# EAGLE design LoRa_Node_Schematic (EAGLE 9.6.2)

## Sheet 1 of 2
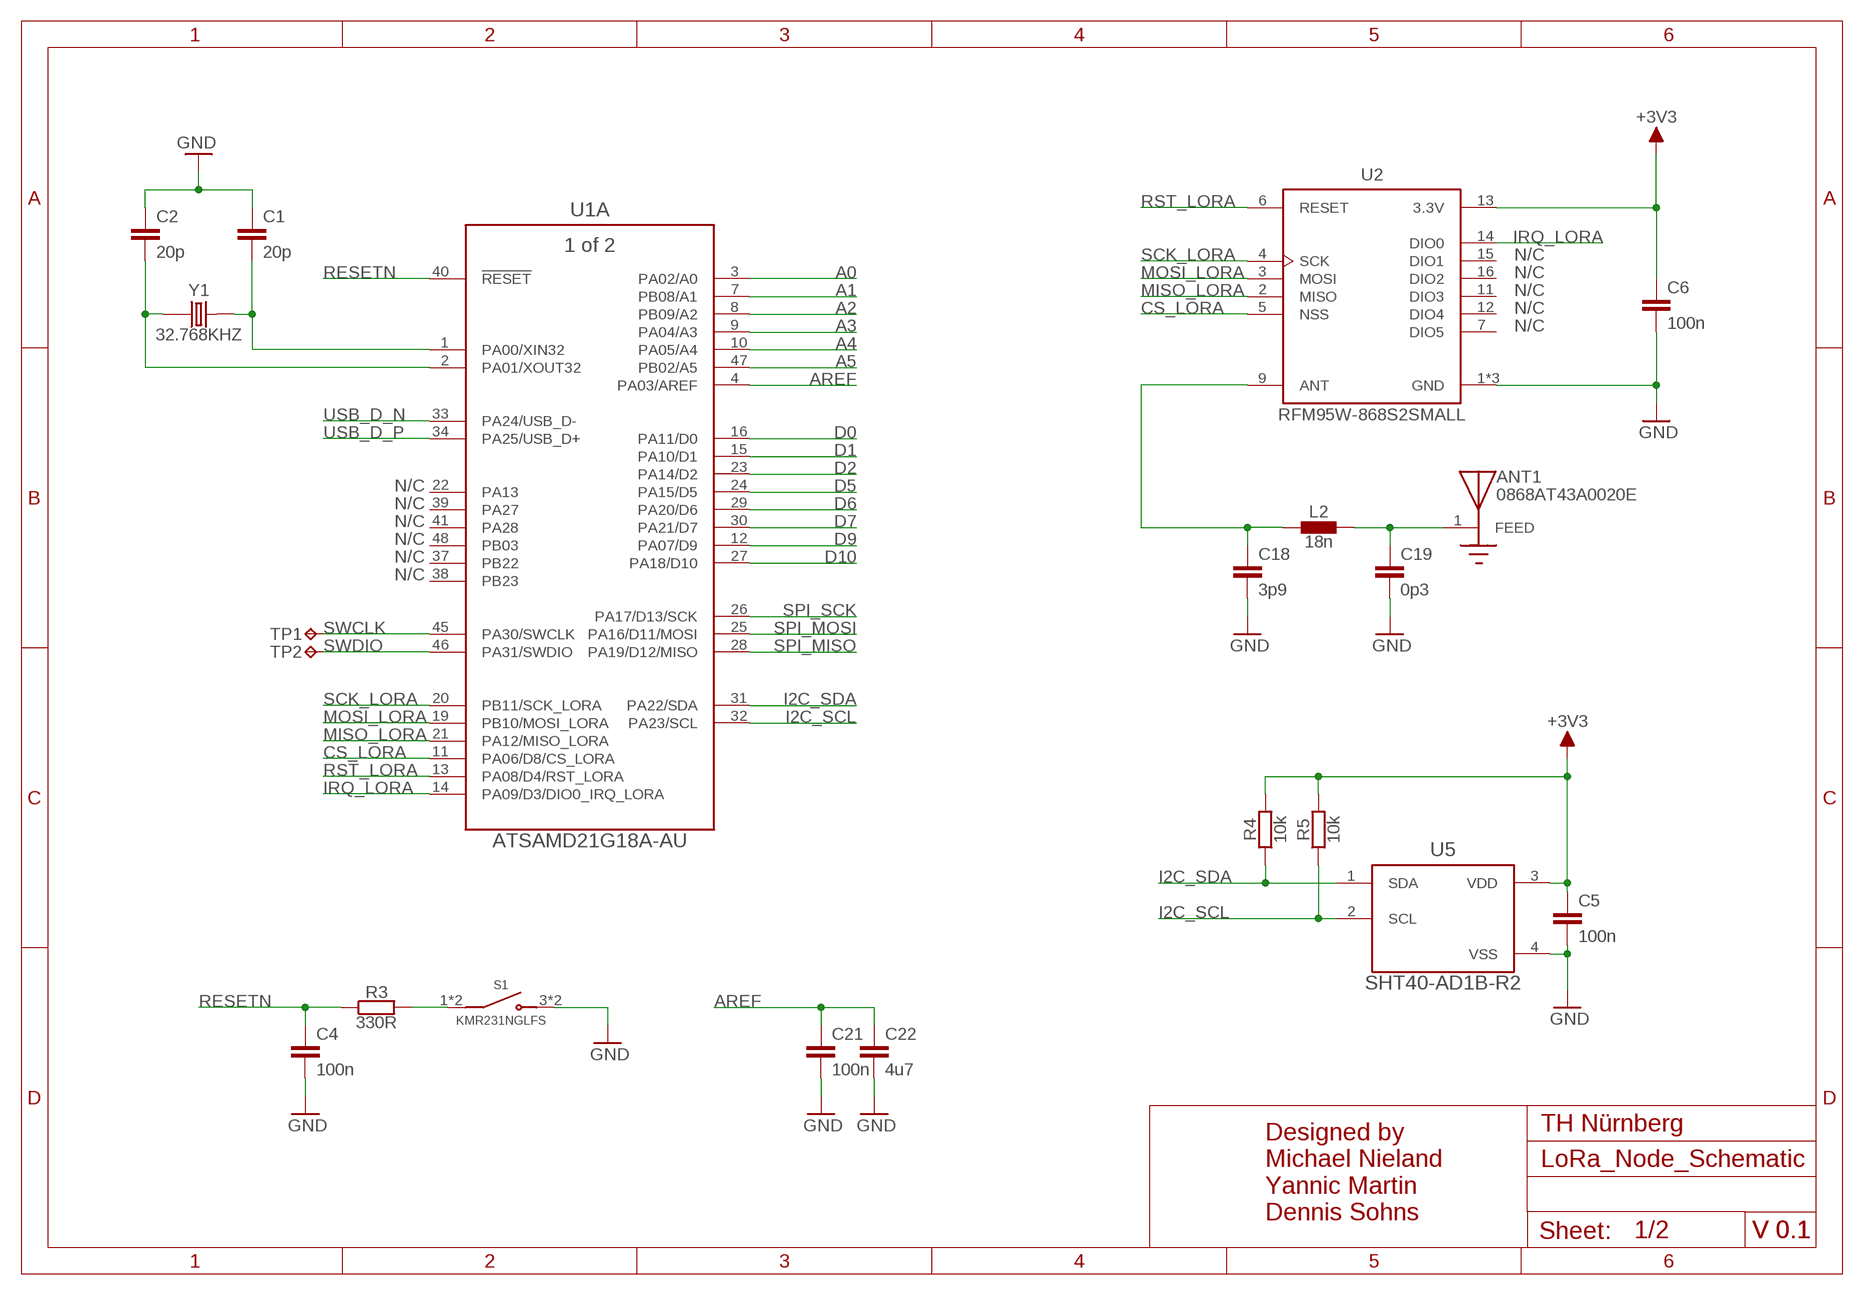
[diagram p0: schematic, sheet 1]

### Parts
ANT1  0868AT43A0020E  [XCVR_0868AT43A0020E]
C1  20p  C-EUC0402  [C0402]
C2  20p  C-EUC0402  [C0402]
C4  100n  C-EUC0402  [C0402]
C5  100n  C-EUC0402  [C0402]
C6  100n  C-EUC0402  [C0402]
C18  3p9  C-EUC0402  [C0402]
C19  0p3  C-EUC0402  [C0402]
C21  100n  C-EUC0402  [C0402]
C22  4u7  C-EUC0603  [C0603]
L2  18n  INDUCTOR_0402_SMD  [R0402]
R3  330R  R-EU_R0402  [R0402]
R4  10k  R-EU_R0402  [R0402]
R5  10k  R-EU_R0402  [R0402]
S1  KMR231NGLFS  [SW_KMR231NGLFS]
TP1  TPTP10R  [TP10R]
TP2  TPTP10R  [TP10R]
U1  ATSAMD21G18A-AU  [TQFP48_7X7MC_MCH]
U2  RFM95W-868S2SMALL  [MICROBUILDER_RFMHCW_SMT]
U5  SHT40-AD1B-R2  [SHT4X_SEN]
Y1  32.768KHZ  ABS07-32.768KHZ-T  [XTAL_ABS07-32.768KHZ-T]

### Nets
+3V3 [Power]: C5.1 C6.1 R4.2 R5.2 U2.13(3.3V) U5.3(VDD) ; also sheet 2
A0: U1.3(A:PA02/A0) ; also sheet 2
A1: U1.7(A:PB08/A1) ; also sheet 2
A2: U1.8(A:PB09/A2) ; also sheet 2
A3: U1.9(A:PA04/A3) ; also sheet 2
A4: U1.10(A:PA05/A4) ; also sheet 2
A5: U1.47(A:PB02/A5) ; also sheet 2
ANTENNA [Antenna]: C18.1 L2.1 U2.9(ANT)
ANTENNA_L [Antenna]: ANT1.1(FEED) C19.1 L2.2
AREF: C21.1 C22.1 U1.4(A:PA03/AREF) ; also sheet 2
CS_LORA: U1.11(A:PA06/D8/CS_LORA) U2.5(NSS)
D0: U1.16(A:PA11/D0) ; also sheet 2
D1: U1.15(A:PA10/D1) ; also sheet 2
D2: U1.23(A:PA14/D2) ; also sheet 2
D5: U1.24(A:PA15/D5) ; also sheet 2
D6: U1.29(A:PA20/D6) ; also sheet 2
D7: U1.30(A:PA21/D7) ; also sheet 2
D9: U1.12(A:PA07/D9) ; also sheet 2
D10: U1.27(A:PA18/D10) ; also sheet 2
GND [Power]: C1.1 C2.1 C4.2 C5.2 C6.2 C18.2 C19.2 C21.2 C22.2 S1.3(NO) S1.4(NO) U2.1(GND) U2.8(GND) U2.10(GND) U5.4(VSS) ; also sheet 2
I2C_SCL: R5.1 U1.32(A:PA23/SCL) U5.2(SCL) ; also sheet 2
I2C_SDA: R4.1 U1.31(A:PA22/SDA) U5.1(SDA) ; also sheet 2
IRQ_LORA: U1.14(A:PA09/D3/DIO0_IRQ_LORA) U2.14(DIO0)
MISO_LORA: U1.21(A:PA12/MISO_LORA) U2.2(MISO)
MOSI_LORA: U1.19(A:PB10/MOSI_LORA) U2.3(MOSI)
RESETN: C4.1 R3.1 U1.40(A:!RESET)
RESETN_R: R3.2 S1.1(COM) S1.2(COM)
RST_LORA: U1.13(A:PA08/D4/RST_LORA) U2.6(RESET)
SCK_LORA: U1.20(A:PB11/SCK_LORA) U2.4(SCK)
SPI_MISO: U1.28(A:PA19/D12/MISO) ; also sheet 2
SPI_MOSI: U1.25(A:PA16/D11/MOSI) ; also sheet 2
SPI_SCK: U1.26(A:PA17/D13/SCK) ; also sheet 2
SWCLK: TP1.TP U1.45(A:PA30/SWCLK)
SWDIO: TP2.TP U1.46(A:PA31/SWDIO)
USB_D_N [Diff]: U1.33(A:PA24/USB_D-) ; also sheet 2
USB_D_P [Diff]: U1.34(A:PA25/USB_D+) ; also sheet 2
XIN32: C1.2 U1.1(A:PA00/XIN32) Y1.2
XOUT32: C2.2 U1.2(A:PA01/XOUT32) Y1.1
Unconnected: U1.22(A:PA13) U1.37(A:PB22) U1.38(A:PB23) U1.39(A:PA27) U1.41(A:PA28) U1.48(A:PB03) U2.7(DIO5) U2.11(DIO3) U2.12(DIO4) U2.15(DIO1) U2.16(DIO2)

### Notes on the sheet
- N/C
- N/C
- N/C
- N/C
- N/C
- N/C
- N/C
- N/C
- N/C
- N/C
- N/C
- TH Nürnberg
- Designed by
  Michael Nieland
  Yannic Martin
  Dennis Sohns
- V 0.1 | V 0.1

## Sheet 2 of 2
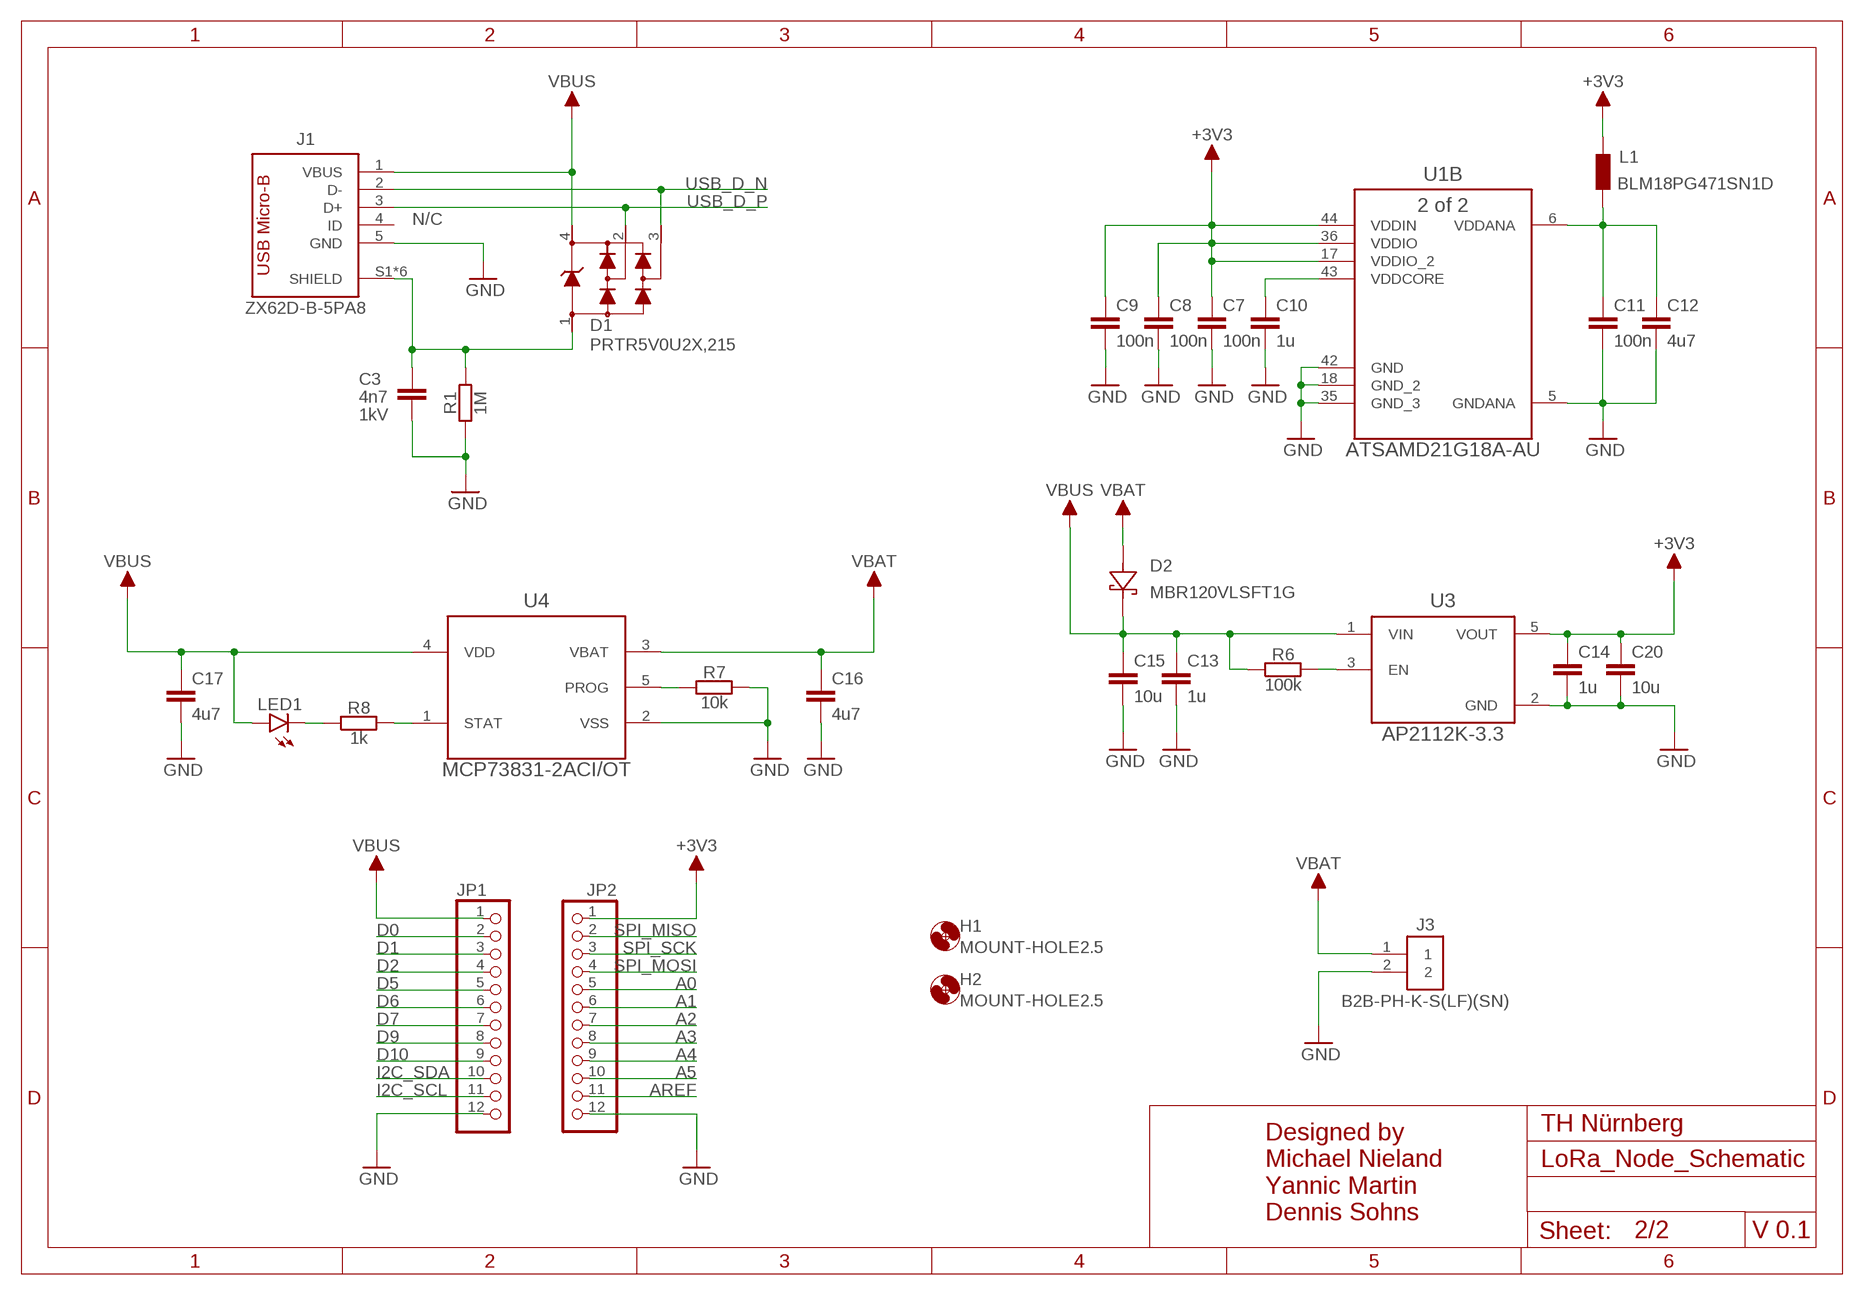
[diagram p1: schematic, sheet 2]

### Parts
C3  4n7  C-EUC0805  [C0805]
C7  100n  C-EUC0402  [C0402]
C8  100n  C-EUC0402  [C0402]
C9  100n  C-EUC0402  [C0402]
C10  1u  C-EUC0402  [C0402]
C11  100n  C-EUC0402  [C0402]
C12  4u7  C-EUC0603  [C0603]
C13  1u  C-EUC0402  [C0402]
C14  1u  C-EUC0402  [C0402]
C15  10u  C-EUC0603  [C0603]
C16  4u7  C-EUC0603  [C0603]
C17  4u7  C-EUC0603  [C0603]
C20  10u  C-EUC0603  [C0603]
D1  PRTR5V0U2X,215  [SOT143B]
D2  MBR120VLSFT1G  [SDO_SOD-123FL_ONS]
H1  MOUNT-HOLE2.5  [MICROBUILDER_MOUNTINGHOLE_2.5_PLATED]
H2  MOUNT-HOLE2.5  [MICROBUILDER_MOUNTINGHOLE_2.5_PLATED]
J1  ZX62D-B-5PA8  [HIROSE_ZX62D-B-5PA8]
J3  B2B-PH-K-S(LF)(SN)  [JST_B2B-PH-K-S(LF)(SN)]
JP1  PINHD-1X12-CB  [1X12-CB]
JP2  PINHD-1X12-CB  [1X12-CB]
L1  BLM18PG471SN1D  [IND_BLM18_0603_MUR]
LED1  LEDCHIP-LED0805  [CHIP-LED0805]
R1  1M  R-EU_R0402  [R0402]
R6  100k  R-EU_R0402  [R0402]
R7  10k  R-EU_R0402  [R0402]
R8  1k  R-EU_R0402  [R0402]
U3  AP2112K-3.3  [SOT95P285X140-5N]
U4  MCP73831-2ACI/OT  [SOT95P280X145-5N]

### Nets
3V3_EN: R6.2 U3.3(EN)
+3V3 [Power]: C7.1 C8.1 C9.1 C14.1 C20.1 JP2.1 L1.1 U1.17(B:VDDIO_2) U1.36(B:VDDIO) U1.44(B:VDDIN) U3.5(VOUT) ; also sheet 1
A0: JP2.5 ; also sheet 1
A1: JP2.6 ; also sheet 1
A2: JP2.7 ; also sheet 1
A3: JP2.8 ; also sheet 1
A4: JP2.9 ; also sheet 1
A5: JP2.10 ; also sheet 1
AREF: JP2.11 ; also sheet 1
D0: JP1.2 ; also sheet 1
D1: JP1.3 ; also sheet 1
D2: JP1.4 ; also sheet 1
D5: JP1.5 ; also sheet 1
D6: JP1.6 ; also sheet 1
D7: JP1.7 ; also sheet 1
D9: JP1.8 ; also sheet 1
D10: JP1.9 ; also sheet 1
GND [Power]: C3.2 C7.2 C8.2 C9.2 C10.2 C11.2 C12.2 C13.2 C14.2 C15.2 C16.2 C17.2 C20.2 J1.5(GND) J3.2 JP1.12 JP2.12 R1.1 R7.2 U1.5(B:GNDANA) U1.18(B:GND_2) U1.35(B:GND_3) U1.42(B:GND) U3.2(GND) U4.2(VSS) ; also sheet 1
I2C_SCL: JP1.11 ; also sheet 1
I2C_SDA: JP1.10 ; also sheet 1
SPI_MISO: JP2.2 ; also sheet 1
SPI_MOSI: JP2.4 ; also sheet 1
SPI_SCK: JP2.3 ; also sheet 1
USB_D_N [Diff]: D1.3 J1.2(D-) ; also sheet 1
USB_D_P [Diff]: D1.2 J1.3(D+) ; also sheet 1
USB_SHIELD: C3.1 D1.1 J1.S1(SHIELD) J1.S2(SHIELD) J1.S3(SHIELD) J1.S4(SHIELD) J1.S5(SHIELD) J1.S6(SHIELD) R1.2
VBAT [Power]: C16.1 D2.2 J3.1 U4.3(VBAT)
VBAT_PROG: R7.1 U4.5(PROG)
VBAT_STAT: R8.2 U4.1(STAT)
VBAT_STAT_R: LED1.C R8.1
VBUS [Power]: C13.1 C15.1 C17.1 D1.4 D2.1 J1.1(VBUS) JP1.1 LED1.A R6.1 U3.1(VIN) U4.4(VDD)
VDDANA [Power]: C11.1 C12.1 L1.2 U1.6(B:VDDANA)
VDDCORE [Power]: C10.1 U1.43(B:VDDCORE)
Unconnected: J1.4(ID)

### Notes on the sheet
- N/C
- TH Nürnberg
- Designed by
  Michael Nieland
  Yannic Martin
  Dennis Sohns
- V 0.1

## Library data of the parts
ANT1 = 0868AT43A0020E:0868AT43A0020E: Antenna 868mhz For Ti Cc11xx; DESCRIPTION: 868MHz Chip RF Antenna 858MHz ~ 878MHz -1dBi Solder Surface Mount; DIGI-KEY_PART_NUMBER: 712-1399-1-ND; MF: Johanson Technology; MP: 0868AT43A0020E; PACKAGE: None; PURCHASE-URL: https://pricing.snapeda.com/search/part/0868AT43A0020E/?ref=eda
C1 C2 C4-C17 C20-C22 = rcl:C-EU: CAPACITOR, European symbol; SPICEPREFIX: C
C3 = rcl:C-EU: CAPACITOR, European symbol; MANUFACTURER: KEMET; MANUFACTURER-PN: C0805C472KDRACTU; SPICEPREFIX: C; VOLTAGE: 1kV
C18 = rcl:C-EU: CAPACITOR, European symbol; MANUFACTURER: Johanson Technology; MANUFACTURE_PN: 500R07S3R9BV4T; SPICEPREFIX: C
C19 = rcl:C-EU: CAPACITOR, European symbol; MANUFACTURER: Johanson Technology; MANUFACTURER_PN: 500R07S0R3BV4T; SPICEPREFIX: C
D1 = PRTR5V0U2X_215:PRTR5V0U2X,215: Ultra low capacitance double rail-to-rail ESD protection diode Check prices <https://pricing.snapeda.com/parts/PRTR5V0U2X%2C215/Nexperia%20USA%20Inc./view-part?ref=eda>; AVAILABILITY: Good; DESCRIPTION: Clamp Ipp Tvs Diode Surface Mount SOT-143B; MF: Nexperia USA Inc.; MP: PRTR5V0U2X,215; PACKAGE: TO-253-4 Nexperia USA Inc.; PRICE: None; PURCHASE-URL: https://pricing.snapeda.com/search/part/PRTR5V0U2X,215/?ref=eda
D2 = MBR120VLSFT1G:MBR120VLSFT1G; BUILT_BY: EMA_Cory; COPYRIGHT: Copyright (C) 2018 Accelerated Designs. All rights reserved; DATASHEET: https://www.onsemi.com/pub/Collateral/MBR120VLSFT1-D.PDF; MANUFACTURER_PART_NUMBER: MBR120VLSFT1G; SOURCELIBRARY: ON_Semiconductor_2020-09-15; VENDOR: ON Semiconductor
H1 H2 = Adafruit Feather M0 RFMxx:MOUNT-HOLE2.5
J1 = ZX62D-B-5PA8:ZX62D-B-5PA8: CONN RCPT USB Check prices <https://pricing.snapeda.com/parts/ZX62D-B-5PA8/Hirose/view-part?ref=eda>; AVAILABILITY: Bad; DESCRIPTION: USB - micro B USB 2.0 Receptacle Connector 5 Position Surface Mount, Right Angle; Through Hole; MF: Hirose; MP: ZX62D-B-5PA8; PACKAGE: None; PRICE: None
J3 = B2B-PH-K-S_LF_SN:B2B-PH-K-S(LF)(SN): PH Series 2 Position 2 mm Pitch Through Hole Top Entry Shrouded Header Check prices <https://pricing.snapeda.com/parts/B2B-PH-K-S%28LF%29%28SN%29/JST%20Sales/view-part?ref=eda>; AVAILABILITY: Good; DESCRIPTION: Connector Header Through Hole 2 position 0.079 (2.00mm); MF: JST Sales; MP: B2B-PH-K-S(LF)(SN); PACKAGE: None; PRICE: None; PURCHASE-URL: https://pricing.snapeda.com/search/part/B2B-PH-K-S(LF)(SN)/?ref=eda
JP1 JP2 = adafruit:PINHD-1X12: PIN HEADER
L1 = BLM18PG471SN1D:BLM18PG471SN1D; BUILT_BY: EMA_UL_Team; MANUFACTURER_PART_NUMBER: BLM18PG471SN1D; SOURCELIBRARY: Murata_2010-01-01IND_BLM; VENDOR: MURATA
L2 = Inductor_SMD:INDUCTOR_0402_SMD; MANUFACTURER: Johanson Technology; MANUFACTURER_PN: L-07C18NJV6T
LED1 = led:LED: LED OSRAM: - CHIPLED LG R971, LG N971, LY N971, LG Q971, LY Q971, LO R971, LY R971 LH N974, LH R974 LS Q976, LO Q976, LY Q976 LO Q996 - Hyper CHIPLED LW Q18S LB Q993, LB Q99A, LB R99A - SideLED LS A670, LO A670, LY A670, LG A670, LP A670 LB A673, LV A673, LT A673, LW A673 LH A674 LY A675 LS A676, LA A676, LO A676, LY A676, LW A676 LS A679, LY A679, LG A679 - Hyper Micro SIDELED® LS Y876, LA Y876, LO Y876, LY Y876 LT Y87S - SmartLED LW L88C, LW L88S LB L89C, LB L89S, LG L890 LS L89K, LO L89K, LY L89K LS L896, LA L896, LO L896, LY L896 - TOPLED LS T670, LO T670, LY T670, LG T670, LP T670 LSG T670, LSP T670, LSY T670, LOP T670, LYG T670 LG T671, LOG T671, LSG T671 LB T673, LV T673, LT T673, LW T673 LH T674 LS T676, LA T676, LO T676, LY T676, LB T676, LH T676, LSB T676, LW T676 LB T67C, LV T67C, LT T67C, LS T67K, LO T67K, LY T67K, LW E67C LS E67B, LA E67B, LO E67B, LY E67B, LB E67C, LV E67C, LT E67C LW T67C LS T679, LY T679, LG T679 LS T770, LO T770, LY T770, LG T770, LP T770 LB T773, LV T773, LT T773, LW T773 LH T774 LS E675, LA E675, LY E675, LS T675 LS T776, LA T776, LO T776, LY T776, LB T776 LHGB T686 LT T68C, LB T68C - Hyper Mini TOPLED® LB M676 - Mini TOPLED Santana® LG M470 LS M47K, LO M47K, LY M47K Source: http://www.osram.convergy.de LUXEON: - LUMILED® LXK2-PW12-R00, LXK2-PW12-S00, LXK2-PW14-U00, LXK2-PW14-V00 LXK2-PM12-R00, LXK2-PM12-S00, LXK2-PM14-U00 LXK2-PE12-Q00, LXK2-PE12-R00, LXK2-PE12-S00, LXK2-PE14-T00, LXK2-PE14-U00 LXK2-PB12-K00, LXK2-PB12-L00, LXK2-PB12-M00, LXK2-PB14-N00, LXK2-PB14-P00, LXK2-PB14-Q00 LXK2-PR12-L00, LXK2-PR12-M00, LXK2-PR14-Q00, LXK2-PR14-R00 LXK2-PD12-Q00, LXK2-PD12-R00, LXK2-PD12-S00 LXK2-PH12-R00, LXK2-PH12-S00 LXK2-PL12-P00, LXK2-PL12-Q00, LXK2-PL12-R00 Source: www.luxeon.com KINGBRIGHT: KA-3528ASYC Source: www.kingbright.com
R1 R3-R8 = rcl:R-EU_: RESISTOR, European symbol; SPICEPREFIX: R
S1 = KMR231NGLFS:KMR231NGLFS: Tactile Switch SPST-NO Top Actuated Surface Mount Check prices <https://pricing.snapeda.com/parts/KMR211NGLFS/C%26K%20Components/view-part?ref=eda>; AVAILABILITY: Good; DESCRIPTION: Tactile Switch SPST-NO Top Actuated Surface Mount; MF: C&K Components; MP: KMR231NGLFS; PACKAGE: None; PRICE: None; PURCHASE-URL: https://pricing.snapeda.com/search/part/KMR211NGLFS/?ref=eda
TP1 TP2 = testpad:TP: Test pad
U1 = ATSAMD21G18A_AU:ATSAMD21G18A-AU; BUILT_BY: EMA_Molly; COPYRIGHT: Copyright (C) 2018 Accelerated Designs. All rights reserved; MANUFACTURER_PART_NUMBER: ATSAMD21G18A-AU; SOURCELIBRARY: Microchip_2019-08-23_25; VENDOR: Microchip
U2 = RFM95W-868S2:RFM95W-868S2: RFM95(W) - Low Power Long Range Transceiver Module V1.0 Check prices <https://pricing.snapeda.com/parts/RFM95W-915S2/RF%20Solutions/view-part?ref=eda>
U3 = AP2112K-3.3:AP2112K-3.3: AP2112 Series 0.6 A 3.3 V Fixed Output SMT LDO Linear Regulator - SOT23-5 Check prices <https://pricing.snapeda.com/parts/AP2112K-3.3TRG1/Diodes%20Inc./view-part?ref=eda>; AVAILABILITY: Good; DESCRIPTION: Linear Voltage Regulator IC 1 Output 600mA SOT-25; MF: Diodes Inc.; MP: AP2112K-3.3; PACKAGE: SOT-753 Diodes Inc.; PRICE: None; PURCHASE-URL: https://pricing.snapeda.com/search/part/AP2112K-3.3TRG1/?ref=eda
U4 = MCP73831-2ACI_OT:MCP73831-2ACI/OT: Charge Management Controller Check prices <https://pricing.snapeda.com/parts/MCP73831T-2ACI/OT/Microchip/view-part?ref=eda>; AVAILABILITY: Good; DESCRIPTION: Charger IC Lithium Ion/Polymer SOT-23-5; MF: Microchip; MP: MCP73831-2ACI/OT; PACKAGE: SOT-23 Microchip; PRICE: None; PURCHASE-URL: https://pricing.snapeda.com/search/part/MCP73831T-2ACI/OT/?ref=eda
U5 = SHT40-AD1B-R2:SHT40-AD1B-R2; BUILT_BY: EMA_Cory; COPYRIGHT: Copyright (C) 2018 Accelerated Designs. All rights reserved; DATASHEET: https://www.mouser.com/datasheet/2/682/Sensirion_10272020_Datasheet_SHT4x-1919523.pdf; MANUFACTURER_PART_NUMBER: SHT40-AD1B-R2; SOURCELIBRARY: Add_to_database_2020-11-16; VENDOR: Sensirion
Y1 = ABS07-32.768KHZ-T:ABS07-32.768KHZ-T: ABS07 Series 32.768 kHz ±20 ppm 12.5 pF -40 to +85 °C SMT Low Profile Crystal; DESCRIPTION: 32.768kHz ±20ppm Crystal 12.5pF 70 kOhms 2-SMD, No Lead; DIGI-KEY_PART_NUMBER: 535-9542-1-ND; MF: Abracon; MP: ABS07-32.768KHZ-T; PACKAGE: SMD-2 Abracon LLC; PURCHASE-URL: https://pricing.snapeda.com/search/part/ABS07-32.768KHZ-T/?ref=eda

## Net classes
0 default: width 0.23 mm, drill 0.2 mm, clearance 0.203 mm
1 Power: width 0.254 mm, drill 0.2 mm, clearance 0.203 mm to class 0, clearance 0.203 mm
2 Diff: width 0.165 mm, drill 0.2 mm, clearance 0.203 mm to class 0, clearance 0.203 mm to class 1, clearance 0.18 mm
3 Antenna: width 0.21 mm, drill 0.2 mm, clearance 0.5 mm to class 0, clearance 0.2 mm to class 1, clearance 0.5 mm to class 2, clearance 0.5 mm

## Board
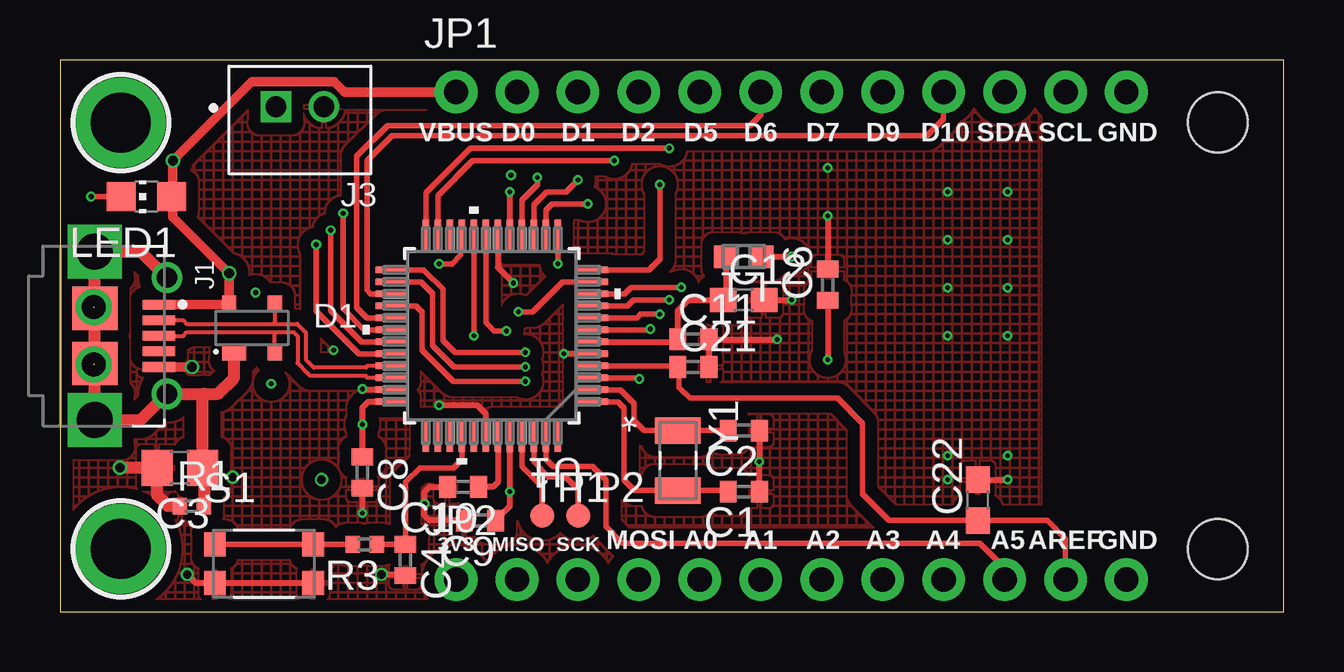
[diagram p2: board, top side]
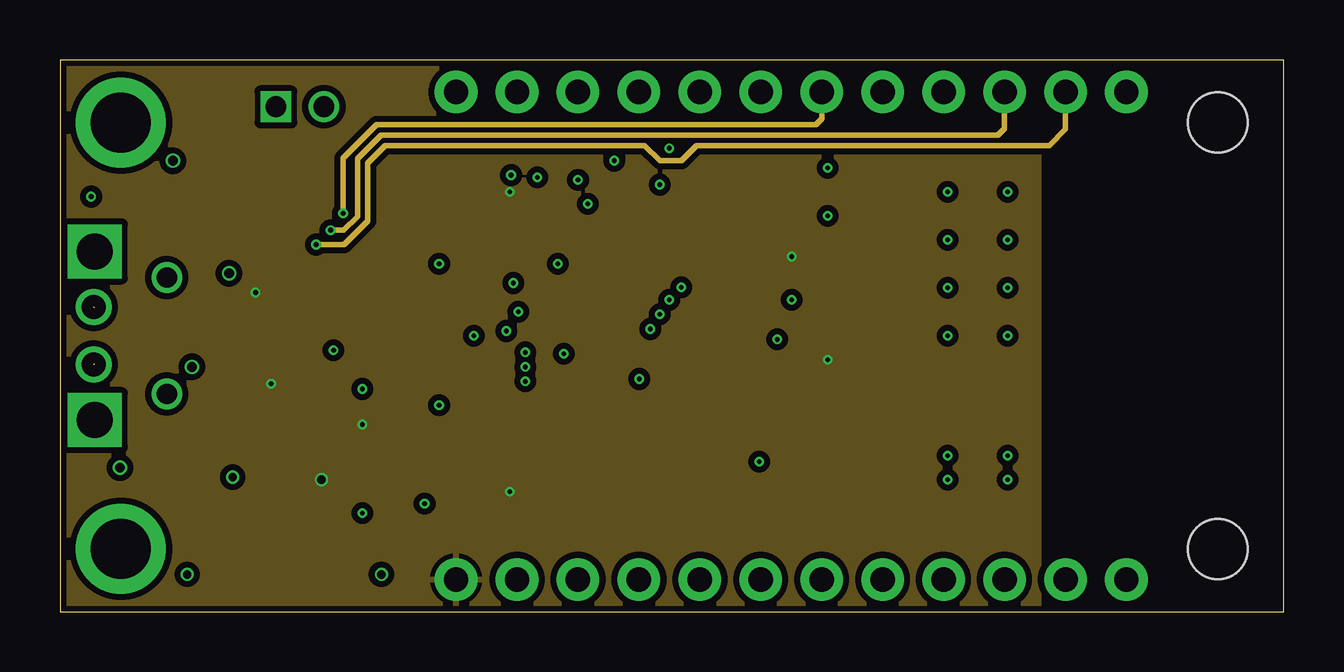
[diagram p3: board, inner layer Route2]
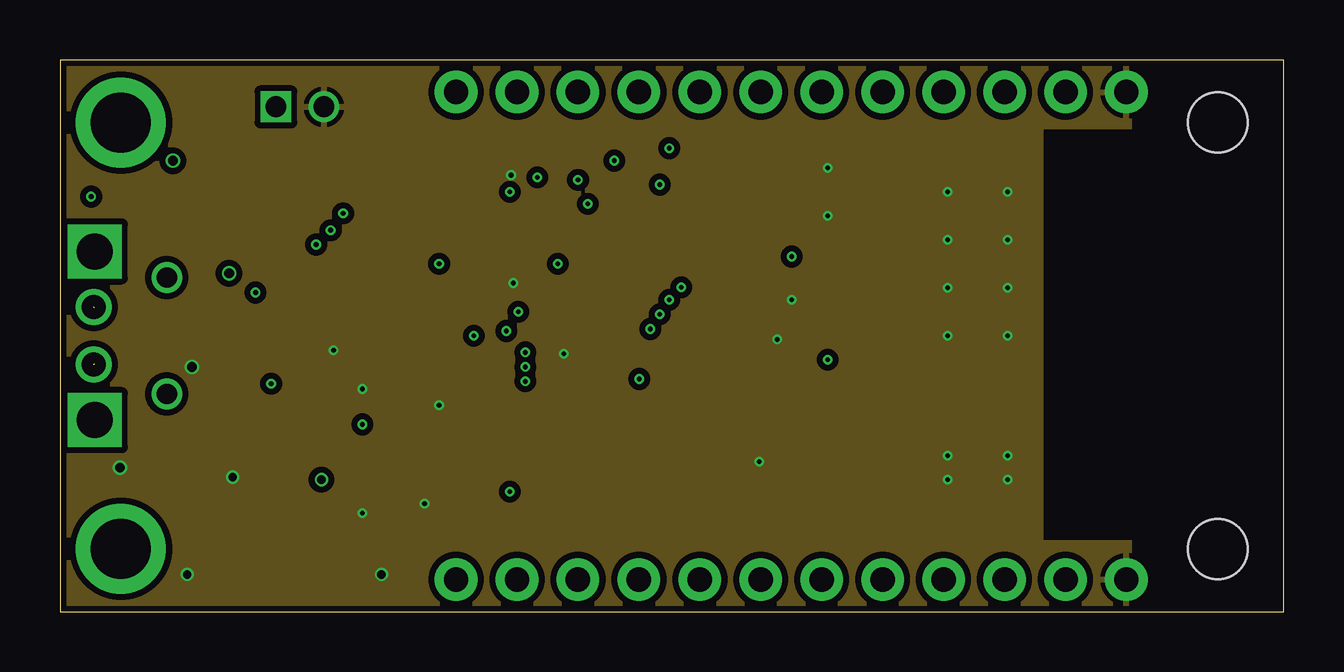
[diagram p4: board, inner layer Route3]
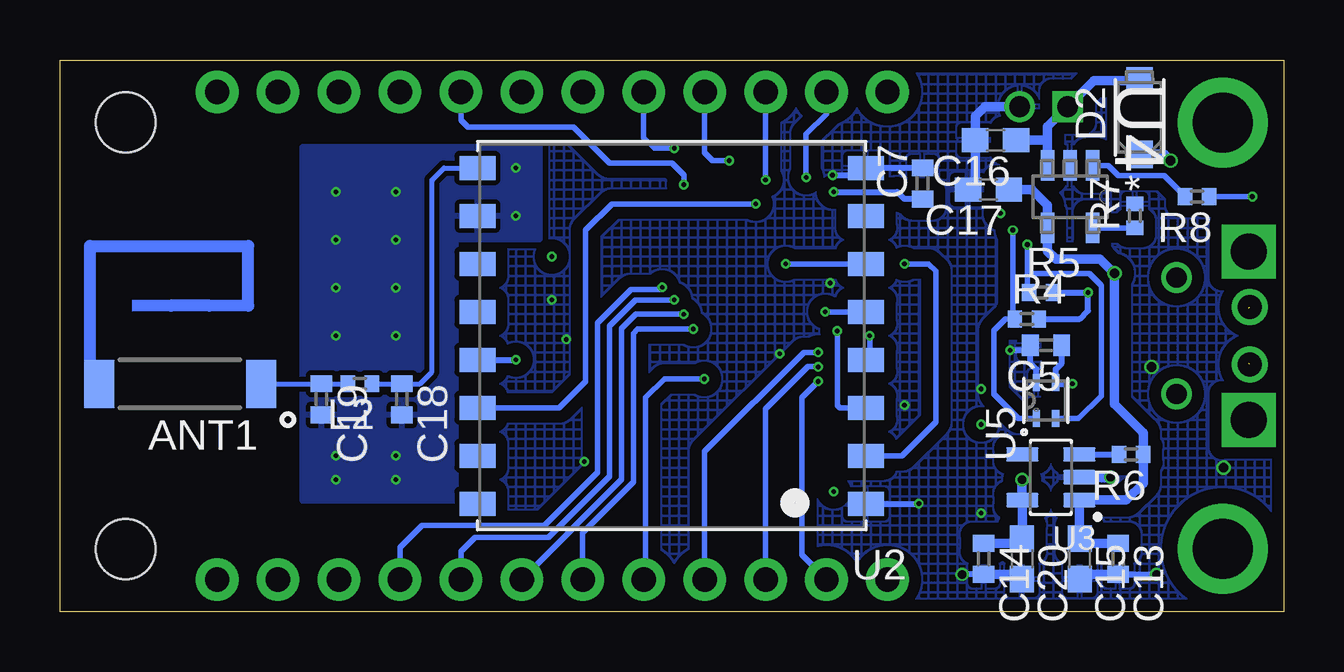
[diagram p5: board, bottom side, seen from below]

Size 51 x 23 mm. Coordinates in mm from the lower left corner, seen from the top.
Outline: 0,0 51,0 51,23 0,23 0,0
Copper layers (1+2*3+16): Top 0.035mm / dielectric 0.14mm / Route2 0.035mm / dielectric 1.2mm / Route3 0.035mm / dielectric 0.14mm / Bottom 0.035mm
Design rules "Multi-CB_4L_100µm-Tracks_OL35µm-IL35µm *": minimum track width 0.1mm, minimum drill 0.2mm, track to track 0.1mm, track to pad 0.1mm, pad to pad 0.1mm, via to via 0.1mm, smd to smd 0mil, copper to edge 0.2mm, drill to drill 0.2mm, minimum pad ring 0.125mm, minimum via ring 0.1mm, stop-mask expansion 2mil, vias tented up to drill 0.45mm, thermal gap 0.2mm
Holes 2.5 mm at 48.26,20.39 48.26,2.61
tRestrict: area 46.3,18.4 to 50.3,22.4; area 46.3,0.6 to 50.3,4.6
bRestrict: area 46.3,18.4 to 50.3,22.4; area 46.3,0.6 to 50.3,4.6

### Footprints (pad centres in the part's own frame; a part is rotated, then mirrored left to right if it is on the bottom)
XCVR_0868AT43A0020E = smd 1.25 x 2: 1 -3.375,0; 2 3.375,0
C0402 = smd 0.7 x 0.9: 1 -0.65,0; 2 0.65,0
C0805 = smd 1.3 x 1.5: 1 -0.95,0; 2 0.95,0
C0603 = smd 1.1 x 1: 1 -0.85,0; 2 0.85,0
SOT143B = smd 1 x 0.7: 1 -0.75,-1 | smd 0.6 x 0.7: 2 0.95,-1; 3 0.95,1; 4 -0.95,1
SDO_SOD-123FL_ONS = smd 1.143 x 1.092: 1 -1.537,0; 2 1.537,0
MICROBUILDER_MOUNTINGHOLE_2.5_PLATED = drill 2.5 pad 3.2: P$1 0,0
HIROSE_ZX62D-B-5PA8 = smd 0.4 x 1.35: 1 -1.3,2.675; 2 -0.65,2.675; 3 0,2.675; 4 0.65,2.675; 5 1.3,2.675 | drill 1.5 square: S1 -3.513,0; S2 3.513,0 | drill 0.85: S3 -2.425,3; S4 2.425,3 | smd 1.8 x 1.9: S5 -1.15,0; S6 1.15,0
JST_B2B-PH-K-S(LF)(SN) = drill 0.86 square: 1 1,-0.55 | drill 0.86: 2 -1,-0.55
1X12-CB = drill 1.016 pad 1.778: 1 -13.97,0; 2 -11.43,0; 3 -8.89,0; 4 -6.35,0; 5 -3.81,0; 6 -1.27,0; 7 1.27,0; 8 3.81,0; 9 6.35,0; 10 8.89,0; 11 11.43,0; 12 13.97,0
IND_BLM18_0603_MUR = smd 0.965 x 0.94: 1 -0.749,0; 2 0.749,0
R0402 = smd 0.6 x 0.7: 1 -0.5,0; 2 0.5,0
CHIP-LED0805 = smd 1.2 x 1.2: A 0,-1.05; C 0,1.05
SW_KMR231NGLFS = smd 0.9 x 1: 1 -2.05,0.8; 2 2.05,0.8; 3 -2.05,-0.8; 4 2.05,-0.8
TP10R = smd 1 x 1: TP 0,0
TQFP48_7X7MC_MCH = smd 1.346 x 0.279: 1 -4.178,2.75; 2 -4.178,2.25; 3 -4.178,1.75; 4 -4.178,1.25; 5 -4.178,0.75; 6 -4.178,0.25; 7 -4.178,-0.25; 8 -4.178,-0.75; 9 -4.178,-1.25; 10 -4.178,-1.75; 11 -4.178,-2.25; 12 -4.178,-2.75; 25 4.178,-2.75; 26 4.178,-2.25; 27 4.178,-1.75; 28 4.178,-1.25; 29 4.178,-0.75; 30 4.178,-0.25; 31 4.178,0.25; 32 4.178,0.75; 33 4.178,1.25; 34 4.178,1.75; 35 4.178,2.25; 36 4.178,2.75 | smd 0.279 x 1.346: 13 -2.75,-4.178; 14 -2.25,-4.178; 15 -1.75,-4.178; 16 -1.25,-4.178; 17 -0.75,-4.178; 18 -0.25,-4.178; 19 0.25,-4.178; 20 0.75,-4.178; 21 1.25,-4.178; 22 1.75,-4.178; 23 2.25,-4.178; 24 2.75,-4.178; 37 2.75,4.178; 38 2.25,4.178; 39 1.75,4.178; 40 1.25,4.178; 41 0.75,4.178; 42 0.25,4.178; 43 -0.25,4.178; 44 -0.75,4.178; 45 -1.25,4.178; 46 -1.75,4.178; 47 -2.25,4.178; 48 -2.75,4.178
MICROBUILDER_RFMHCW_SMT = smd 1.5 x 1: 1 -8.1,7; 2 -8.1,5; 3 -8.1,3; 4 -8.1,1; 5 -8.1,-1; 6 -8.1,-3; 7 -8.1,-5; 8 -8.1,-7; 9 8.1,-7; 10 8.1,-5; 11 8.1,-3; 12 8.1,-1; 13 8.1,1; 14 8.1,3; 15 8.1,5; 16 8.1,7
SOT95P285X140-5N = smd 1.35 x 0.6: 1 -1.185,0.95; 2 -1.185,0; 3 -1.185,-0.95; 4 1.185,-0.95; 5 1.185,0.95
SOT95P280X145-5N = smd 1.27 x 0.559: 1 -1.295,0.94; 2 -1.295,0; 3 -1.295,-0.94; 4 1.295,-0.94; 5 1.295,0.94
SHT4X_SEN = smd 0.711 x 0.305: 1 -0.749,0.4; 2 -0.749,-0.4; 3 0.749,-0.4; 4 0.749,0.4
XTAL_ABS07-32.768KHZ-T = smd 1.1 x 1.9: 1 -1.25,0; 2 1.25,0

### Placement (x,y rotation side)
ANT1  46,9.5 180 bottom
C1  28.5,5 180 top
C2  28.5,7.55 180 top
C3  5,6 180 top
C4  14.4,2.15 270 top
C5  9.9,11.1 180 bottom
C6  32,13.63 90 top
C7  15.05,17.85 90 bottom
C8  12.6,5.8 270 top
C9  17.5,3.8 180 top
C10  16.8,5.2 180 top
C11  26.4,11.35 0 top
C12  28.5,13 0 top
C13  6.9,2.2 270 bottom
C14  12.5,2.2 270 bottom
C15  8.5,2.2 270 bottom
C16  12,19.65 180 bottom
C17  12.3,17.6 180 bottom
C18  36.75,8.85 270 bottom
C19  40.1,8.85 270 bottom
C20  10.9,2.2 270 bottom
C21  26.4,10.2 0 top
C22  38.25,4.65 90 top
D1  8,11.82 0 top
D2  6,20.6 90 bottom
H1  2.54,2.61 0 top
H2  2.54,20.39 0 top
J1  1.45,11.5 270 top
J3  10,20.5 180 top
JP1  30.48,21.66 0 top
JP2  30.48,1.34 0 top
L1  28.5,14.8 180 top
L2  38.5,9.5 180 bottom
LED1  3.6,17.3 90 top
R1  5.5,4.4 0 top
R3  12.7,2.8 180 top
R4  10.7,12.2 0 bottom
R5  10.1,13.3 0 bottom
R6  6.35,6.55 180 bottom
R7  6.2,16.5 90 bottom
R8  3.6,17.3 180 bottom
S1  8.5,2 0 top
TP1  20.1,4 0 top
TP2  21.6,4 0 top
U1  18,11.5 180 top
U2  25.5,11.5 180 bottom
U3  9.7,5.6 180 bottom
U4  8.9,17.3 270 bottom
U5  9.9,8.8 90 bottom
Y1  25.75,6.3 270 top

### Tracks (layer width: path | path; a pad name or v marks a point on that pad's centre or on a via)
3V3_EN
  Bottom 0.254: U3.3 R6.2
+3V3  (via drill 0.2, 0.35)
  Top 0.254: C6.1 v32,10.5 | U1.44 v18.75,5 18.75,4.4 C9.1 | U1.17 v18.75,17.5 | L1.1 v30.5,14.8 | U1.36 12.85,8.75 12.6,8.5 v12.6,7.8 C8.1
  Bottom 0.254: U2.13 v32,10.5 | C7.1 15.8,17.2 16.1,17.5 v18.75,17.5 | C5.1 9.25,10.35 9.5,10.1 U5.3 9.45,9.5 v8.8,9.5 | R5.2 v8.15,13.3 8.15,12.55 8.5,12.2 R4.2
  Bottom 0.4: C14.1 11.1,2.85 C20.1 10.88,3.06 U3.5 10.9,4.67 v10.9,5.5
  pour Route2 (isolate 0.254): 0,23 0,0 40.8,0 40.8,23
A0  (via drill 0.2)
  Top 0.23: U1.3 24.1,9.75 v24.15,9.7
  Bottom 0.23: v24.15,9.7 25.8,9.7 26.6,8.93 26.6,1.44 JP2.5
A1  (via drill 0.2)
  Top 0.23: U1.7 24.57,11.75 v24.6,11.78
  Bottom 0.23: v24.6,11.78 26.92,11.78 27.1,11.6 27.1,5.4 29.21,3.29 JP2.6
A2  (via drill 0.2)
  Top 0.23: U1.8 24.05,12.25 24.2,12.4 v25,12.4
  Bottom 0.23: v25,12.4 27,12.4 27.6,11.8 27.6,5.51 29.64,3.47 29.64,3.45 JP2.7
A3  (via drill 0.2)
  Top 0.23: U1.9 23.65,12.75 23.9,13 v25.4,13
  Bottom 0.23: v25.4,13 27.01,13 28.1,11.91 28.1,5.62 30.62,3.1 33.7,3.1 34.29,2.51 JP2.8
A4  (via drill 0.2)
  Top 0.23: U1.10 23.54,13.25 23.81,13.52 v25.9,13.52
  Bottom 0.23: v25.9,13.52 25.98,13.43 27.19,13.43 28.6,12.03 28.6,5.8 30.8,3.6 35.9,3.6 36.83,2.67 JP2.9
A5
  Top 0.23: U1.47 20.25,6.35 20.55,6.05 22.2,6.05 22.75,5.5 22.75,3.55 23.45,2.85 38.35,2.85 39.37,1.83 JP2.10
ANTENNA
  Bottom 0.21: U2.9 35,18.5 35.5,18 35.5,10 36,9.5 C18.1 37,9.5 L2.1
ANTENNA_L
  Bottom 0.21: ANT1.1 40.5,9.5 40.35,9.5 | 40.35,9.5 L2.2 | C19.1 40.35,9.5
AREF
  Top 0.23: U1.4 25.65,10.25 | C21.1 25.8,10.1 25.8,9.35 26.25,8.9 32.4,8.9 33.45,7.85 33.45,4.9 34.55,3.8 C22.1 41.15,3.8 41.91,3.04 JP2.11
  Top 0.254: 25.65,10.25 C21.1
CS_LORA  (via drill 0.2)
  Top 0.23: U1.11 20.95,13.75 19.7,12.5 v19.1,12.5
  Bottom 0.23: v19.1,12.5 U2.5
D0  (via drill 0.2)
  Top 0.23: U1.16 19.25,17.15 19.9,17.8 v19.9,18.1
  Bottom 0.23: JP1.2 19.05,20.75 19.9,19.9 v19.9,18.1
D1  (via drill 0.2)
  Top 0.23: v21.59,18 21.09,17.5 20.29,17.5 19.75,16.96 U1.15
  Bottom 0.23: JP1.3 v21.59,18
D2  (via drill 0.2)
  Top 0.23: U1.23 15.75,17.35 17.2,18.8 v23.1,18.8
  Bottom 0.23: JP1.4 24.13,19.13 23.8,18.8 v23.1,18.8
D5  (via drill 0.2)
  Top 0.23: U1.24 15.25,17.46 17.11,19.32 v25.4,19.32
  Bottom 0.23: JP1.5 26.67,19.77 26.22,19.32 v25.4,19.32
D6
  Top 0.23: U1.29 12.8,12.25 12.37,12.68 12.37,18.98 13.66,20.27 28.77,20.27 29.21,20.71 JP1.6
D7  (via drill 0.2)
  Top 0.23: U1.30 12.69,11.75 11.8,12.64 v11.8,16.6
  Route2 0.23: v11.8,16.6 11.8,18.9 13.2,20.3 31.5,20.3 31.75,20.55 JP1.7
D9  (via drill 0.2)
  Top 0.23: U1.12 24.55,14.25 25,14.7 v25,17.8
  Bottom 0.23: v25,17.8 25,18.2 25.5,18.7 28.1,18.7 29.6,20.2 34,20.2 34.29,20.49 JP1.8
D10
  Top 0.23: U1.27 12.95,13.25 12.8,13.4 12.8,18.8 13.84,19.84 36.14,19.84 36.83,20.53 JP1.9
GND  (via drill 0.2, 0.35, 0.4)
  Top 0.254: v32,16.5 C6.2 | S1.4 S1.3 5.65,1.2 v5.3,1.55 | v13.4,1.55 14.35,1.55 C4.2 | C2.1 v29.15,6.25 C1.1 | C22.2 v39.5,5.5 | C10.2 15.4,5.2 15.2,5 v15.2,4.5 15.2,4 15.4,3.8 C9.2 | U1.5 v21,10.75 | U1.35 12.63,9.25 v12.6,9.28 | U1.42 17.75,8.25 17.4,8.6 v15.8,8.6 | U1.18 18.25,14.35 v18.9,13.7 | C21.2 C11.2 v29.9,11.35 | C12.2 v30.5,13 | C8.2 v12.6,4.1
  Top 0.4: J1.5 v5.5,10.2
  Top 0.5: v2.5,6 C3.2 4.05,4.85 4.5,4.4 R1.1
  Bottom 0.254: C14.2 v13.4,1.55 | C13.2 v5.3,1.55 | U2.1 v15.2,4.5 | C7.2 U2.8 17.7,18.2 v18.8,18.2 | v11.4,10.9 10.75,10.9 C5.2 10.55,10.35 10.3,10.1 U5.4
  Bottom 0.4: C17.2 12.85,17.9 C16.2 12.85,20.65 12.45,21.05 J3.2 | C14.2 11.1,1.55 C20.2 | C13.2 8.3,1.55 C15.2 | U3.2 v7.2,5.6
  other vias: 37,11.5 39.5,6.5 37,17.5 37,5.5 39.5,11.5 39.5,13.5 39.5,15.5 39.5,17.5 37,15.5 37,13.5 37,6.5 32,18.5
  pour Route3 (isolate 0.254): 0,0 0,23 45.1,23 45.1,0
  cutout Route3: 51,18.5 41,18.5 41,4.5 51,4.5
  pour Bottom (isolate 0.2): 40.9,19.4 31,19.4 31,15.5 34.5,15.5 34.5,4.6 40.9,4.6
  pour Bottom (isolate 0.5, hatched): 0,23 0,0 40.9,0 40.9,4.2 34.1,4.2 34.1,15.1 30.6,15.1 30.6,19.8 40.9,23
  pour Top (isolate 0.5, hatched): 0,23 0,0 40.9,0 40.9,23
  cutout Route3: 45.3,2.2 44.7,2.2 44.7,2.9 45.3,2.9
  cutout Route3: 41,4.5 41,3.1 41,3 44.7,3 44.7,4.5
  cutout Route3: 41,18.5 45.4,18.5 45.4,20.1 41,20.1
  cutout Route3: 45.4,20.7 44.7,20.7 44.7,20.1 45.4,20.1
I2C_SCL  (via drill 0.2)
  Top 0.23: v10.68,15.3 10.68,12.53 12.46,10.75 U1.32
  Route2 0.23: v10.68,15.3 11.85,15.3 12.83,16.29 12.83,18.71 13.56,19.43 24.37,19.43 25,18.8 25.9,18.8 26.53,19.43 41.23,19.43 41.91,20.11 JP1.11
  Bottom 0.23: v10.68,15.3 10.68,14.1 | 10.68,14.1 10.68,13.38 R5.1 | U5.2 8.55,8.05 7.6,9 7.6,13.6 8.1,14.1 10.68,14.1
I2C_SDA  (via drill 0.2)
  Top 0.23: v11.28,15.9 11.28,12.54 12.57,11.25 U1.31
  Route2 0.23: JP1.10 39.37,20.14 39.1,19.87 13.38,19.87 12.4,18.89 12.4,16.47 11.83,15.9 v11.28,15.9
  Bottom 0.23: v11.28,15.9 11.28,12.28 R4.1 11.6,12.2 12.08,11.72 12.08,9.08 11.05,8.05 U5.1
IRQ_LORA  (via drill 0.2)
  Top 0.23: U1.14 20.25,16.75 20.5,17 v22,17
  Bottom 0.23: v22,17 28,17 29.1,15.9 29.1,9.6 30.2,8.5 U2.14
MISO_LORA  (via drill 0.2)
  Top 0.23: U1.21 16.71,15.64 16.71,14.87 16.33,14.5 v15.8,14.5
  Bottom 0.23: U2.2 15.9,6.5 15.62,6.78 14.5,7.9 14.5,14.2 14.8,14.5 v15.8,14.5
MOSI_LORA  (via drill 0.2)
  Top 0.23: U1.19 17.75,12.05 18.1,11.7 v18.6,11.7
  Bottom 0.23: v18.6,11.7 18.6,8.6 18.5,8.5 U2.3
RESETN
  Top 0.23: R3.1 C4.1 14.4,5.4 15,6 16.4,6 16.75,6.35 U1.40
RESETN_R
  Top 0.23: S1.1 S1.2 R3.2
RST_LORA  (via drill 0.2)
  Top 0.23: U1.13 v20.75,14.5
  Bottom 0.23: v20.75,14.5 U2.6
SCK_LORA  (via drill 0.2)
  Top 0.23: U1.20 v17.25,11.5
  Bottom 0.23: U2.4 17.25,10.65 v17.25,11.5
SPI_MISO  (via drill 0.2)
  Top 0.23: U1.28 14.85,12.75 15.1,12.5 15.1,10.9 16.4,9.6 v19.4,9.6
  Bottom 0.23: JP2.2 20.07,2.36 20.07,8.93 v19.4,9.6
SPI_MOSI  (via drill 0.2)
  Top 0.23: v19.4,10.81 16.46,10.81 15.97,11.3 15.97,13.45 15.16,14.25 U1.25
  Bottom 0.23: v19.4,10.81 19.99,10.81 24.13,6.67 JP2.4
SPI_SCK  (via drill 0.2)
  Top 0.23: U1.26 15.05,13.75 15.53,13.27 15.53,11.1 16.43,10.2 v19.4,10.2
  Bottom 0.23: v19.4,10.2 19.41,10.22 19.82,10.22 21.59,8.44 JP2.3
SWCLK
  Top 0.23: U1.45 19.25,6.05 20.1,5.2 TP1.TP
SWDIO
  Top 0.23: U1.46 19.75,6.24 20.37,5.62 21.08,5.62 21.6,5.1 TP2.TP
USB_D_N
  Top 0.165: J1.2 5.13,12.15 5.28,12 8.9,12 | 8.9,12 9.89,12 10.24,11.64 10.24,10.5 10.37,10.38 10.58,10.17 12.74,10.17 12.82,10.25 U1.33 | D1.3 8.95,12.05 8.9,12
USB_D_P
  Top 0.165: J1.3 5.13,11.5 5.28,11.65 8.9,11.65 | 8.9,11.65 9.75,11.65 9.9,11.5 9.9,10.36 10.33,9.93 | D1.2 8.95,11.6 8.9,11.65 | U1.34 12.82,9.75 12.74,9.83 10.43,9.83 10.33,9.93 | 10.33,9.93
USB_SHIELD  (via drill 1)  (2 unrouted)
  Top 0.254: J1.S5 2.22,11.88 | C3.1 6,5.95
  Top 0.5: J1.S3 3.36,15.01 J1.S1 J1.S5 J1.S6 J1.S2 3.36,7.99 J1.S4 6,9.07 | 6,9.07 6.58,9.07 7.25,9.75 D1.1 | C3.1 5.95,9.03 6,9.07 | 6,5.95 R1.2
  other vias: 1.4,12.7 1.4,10.3
VBAT
  Bottom 0.4: D2.2 7.91,22.14 J3.1 9.84,20.21 9.84,19.65 | U4.3 9.84,19.65 | C16.1 9.84,19.65
VBAT_PROG
  Bottom 0.23: U4.5 R7.1
VBAT_STAT
  Bottom 0.23: R8.2 4.97,18.17 6.88,18.17 7.3,18.59 U4.1
VBAT_STAT_R  (via drill 0.2)
  Top 0.23: v1.3,17.3 LED1.C
  Bottom 0.23: R8.1 v1.3,17.3
VBUS  (via drill 0.4)
  Top 0.254: 7.03,12.8 D1.4
  Top 0.4: LED1.A 4.7,17.35 | 4.7,17.35 v4.7,18.8 8,22.1 11.43,22.1 11.87,21.66 JP1.1 | J1.1 7.03,12.8 | D1.4 v7.05,14.1 4.7,16.45 4.7,17.35
  Bottom 0.4: D2.1 4.96,19.06 v4.7,18.8 | C17.1 10.5,17.6 9.84,16.94 U4.4 9.84,15.04 9.5,14.7 7.65,14.7 v7.05,14.1 7.05,8.65 5.85,7.45 R6.1 5.85,5.35 6.55,4.65 U3.1 8.52,3.06 C15.1 8.3,2.85 C13.1
VDDANA
  Top 0.254: U1.6 25.65,11.25 C11.1 25.75,12.55 26.2,13 C12.1 27.75,13.1 L1.2
VDDCORE
  Top 0.254: U1.43 18.25,5.4 18.05,5.2 C10.1
XIN32
  Top 0.23: U1.1 23.25,8.75 23.5,8.5 23.5,5.5 23.95,5.05 Y1.2 27.8,5.05 C1.2
XOUT32
  Top 0.23: U1.2 23.36,9.25 23.93,8.68 23.93,7.97 24.35,7.55 Y1.1 C2.2

### Text on the board
tPlace: VBUS | D0 | D1 | D2 | D5 | D6 | D7 | D9 | D10 | SDA | SCL | GND | 3V3 | MISO | SCK | MOSI | A0 | A1 | A2 | A3 | A4 | A5 | AREF | GND